# Altium schematic sheet [06] - LEDs.SchDoc
size A4
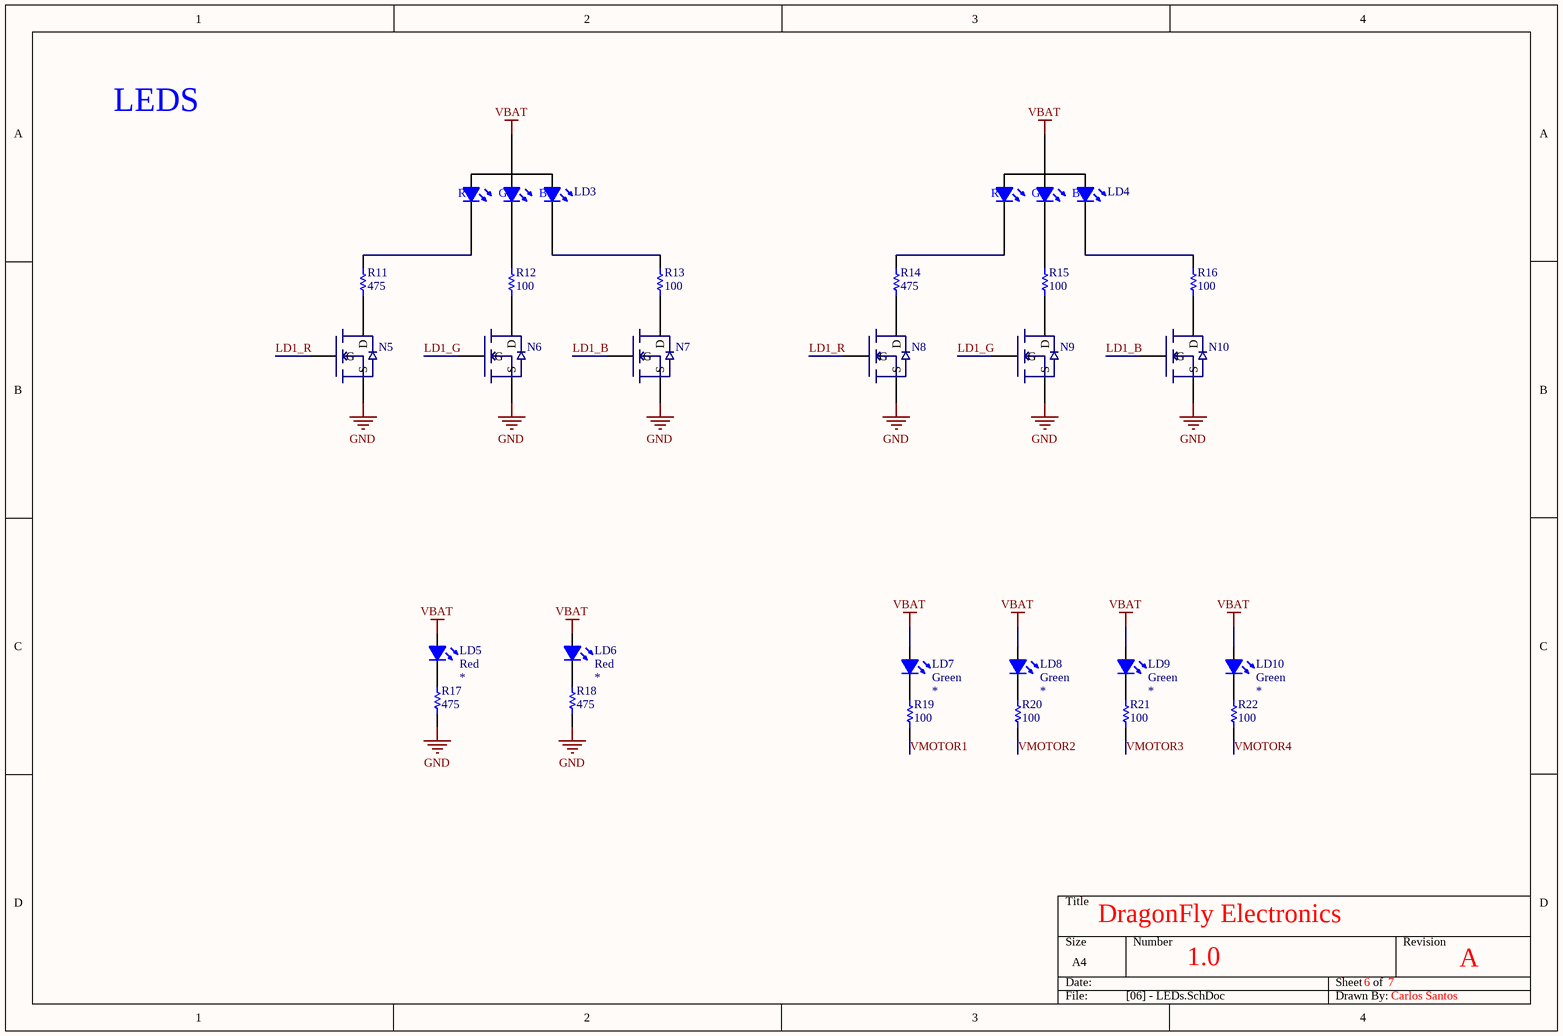
[diagram p0: [06] - LEDs.SchDoc]

## Parts
LD3  1  [0404 RGD Led]  (value not drawn)
LD4  1  [0404 RGD Led]  (value not drawn)
LD5  Color: Red  [0603 - led]  (hidden comment: Led)
LD6  Color: Red  [0603 - led]  (hidden comment: Led)
LD7  Color: Green  [0603 - led]  (hidden comment: Led)
LD8  Color: Green  [0603 - led]  (hidden comment: Led)
LD9  Color: Green  [0603 - led]  (hidden comment: Led)
LD10  Color: Green  [0603 - led]  (hidden comment: Led)
N5  N-MOSFET  [DFN1006-3]  (value not drawn)
N6  N-MOSFET  [DFN1006-3]  (value not drawn)
N7  N-MOSFET  [DFN1006-3]  (value not drawn)
N8  N-MOSFET  [DFN1006-3]  (value not drawn)
N9  N-MOSFET  [DFN1006-3]  (value not drawn)
N10  N-MOSFET  [DFN1006-3]  (value not drawn)
R11  value 475  [0402 - Resistor]  (hidden comment: Resistor)
R12  value 100  [0402 - Resistor]  (hidden comment: Resistor)
R13  value 100  [0402 - Resistor]  (hidden comment: Resistor)
R14  value 475  [0402 - Resistor]  (hidden comment: Resistor)
R15  value 100  [0402 - Resistor]  (hidden comment: Resistor)
R16  value 100  [0402 - Resistor]  (hidden comment: Resistor)
R17  value 475  [0402 - Resistor]  (hidden comment: Resistor)
R18  value 475  [0402 - Resistor]  (hidden comment: Resistor)
R19  value 100  [0402 - Resistor]  (hidden comment: Resistor)
R20  value 100  [0402 - Resistor]  (hidden comment: Resistor)
R21  value 100  [0402 - Resistor]  (hidden comment: Resistor)
R22  value 100  [0402 - Resistor]  (hidden comment: Resistor)

## Nets
GND: N5.1(S) N6.1(S) N7.1(S) N8.1(S) N9.1(S) N10.1(S) R17.1 R18.1
VBAT: LD3.1(A) LD4.1(A) LD5.1(A) LD6.1(A) LD7.1(A) LD8.1(A) LD9.1(A) LD10.1(A)
LD1_B: N7.2(G) N10.2(G)
LD1_G: N6.2(G) N9.2(G)
LD1_R: N5.2(G) N8.2(G)
VMOTOR1: R19.1
VMOTOR2: R20.1
VMOTOR3: R21.1
VMOTOR4: R22.1
NetLD3_2: LD3.2(K) R11.2
NetLD3_3: LD3.3 R12.2
NetLD3_4: LD3.4 R13.2
NetLD4_2: LD4.2(K) R14.2
NetLD4_3: LD4.3 R15.2
NetLD4_4: LD4.4 R16.2
NetLD5_2: LD5.2(K) R17.2
NetLD6_2: LD6.2(K) R18.2
NetLD7_2: LD7.2(K) R19.2
NetLD8_2: LD8.2(K) R20.2
NetLD9_2: LD9.2(K) R21.2
NetLD10_2: LD10.2(K) R22.2
NetN5_3: N5.3(D) R11.1
NetN6_3: N6.3(D) R12.1
NetN7_3: N7.3(D) R13.1
NetN8_3: N8.3(D) R14.1
NetN9_3: N9.3(D) R15.1
NetN10_3: N10.3(D) R16.1

## Notes on the sheet
- LEDS
- DragonFly Electronics
- 1.0
- 6
- 7
- A
- Carlos Santos
- (in symbol RGB LED) R; G; B

## Library data of the parts
LD3 LD4 = RGB LED: DigiKey Part #: 475-3597-1-ND
LD5-LD10 = Led: Vf: *